# Altium project INS_CAN.PrjPcb
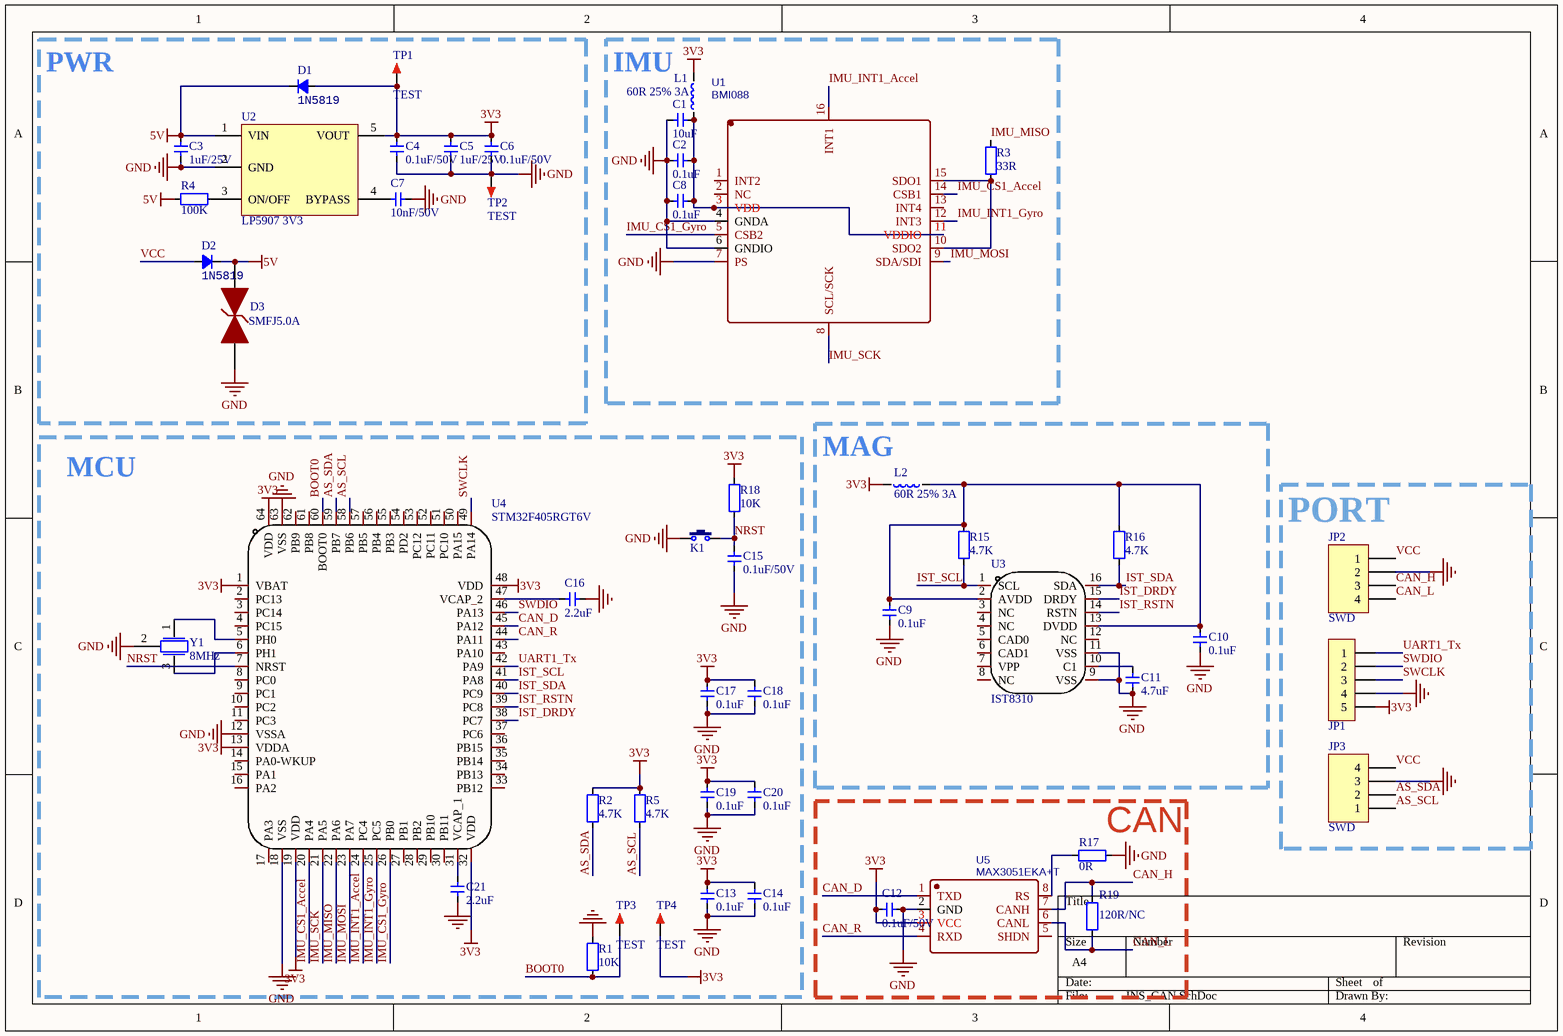
[diagram p0: INS_CAN.SchDoc]
1 sheet, 50 parts. Net scope: global (net labels, ports and power ports of the same name join across sheets).
Board file: INS_CAN.PcbDoc

## Sheet INS_CAN.SchDoc
size A4

### Parts
C1  10uF  [C0402]
C2  0.1uF  [C0402]
C3  1uF/25V  [C0402]
C4  0.1uF/50V  [C0402]
C5  1uF/25V  [C0402]
C6  0.1uF/50V  [C0402]
C7  10nF/50V  [C0402]
C8  0.1uF  [C0402]
C9  0.1uF  [C0402]
C10  0.1uF  [C0402]
C11  4.7uF  [C0402]
C12  0.1uF/50V  [C0402]
C13  0.1uF  [C0402]
C14  0.1uF  [C0402]
C15  0.1uF/50V  [C0402]
C16  2.2uF  [C0402]
C17  0.1uF  [C0402]
C18  0.1uF  [C0402]
C19  0.1uF  [C0402]
C20  0.1uF  [C0402]
C21  2.2uF  [C0402]
D1  1N5819  [D_SOD323]
D2  1N5819  [D_SOD323]
D3  SMFJ5.0A  [D_SOD123A]
JP1  HDR-1X5  [MX 1.25-WS-5P]  (value not drawn)
JP2  SWD  [GH1.25-WS-4P]
JP3  SWD  [GH1.25-WS-4P]
K1  6x6x5  [SWPBS_SPST_3X2X1]  (value not drawn)
L1  60R 25% 3A  [R0402]
L2  60R 25% 3A  [R0402]
R1  10K  [R0402]
R2  4.7K  [R0402]
R3  33R  [R0402]
R4  100K  [R0402]
R5  4.7K  [R0402]
R15  4.7K  [R0402]
R16  4.7K  [R0402]
R17  0R  [R0402]
R18  10K  [R0402]
R19  120R/NC  [R0402]
TP1  TEST  [TEST 1]
TP2  TEST  [TEST 1]
TP3  TEST  [TEST 1]
TP4  TEST  [TEST 1]
U1  BMI088  [QFN16 BMI]
U2  LP5907 3V3  [SOT23-5L]
U3  IST8310  [QFN50_16T_3X3_IST]
U4  STM32F405RGT6V  [LQFP64 10x10_L]
U5  MAX3051EKA+T  [SOT23-8L]
Y1  8MHz  [CSTCE3213]

### Blocks framed on the sheet
PWR: C3-C7 D1-D3 R4 TP1 TP2 U2
IMU: C1 C2 C8 L1 R3 U1
MCU: C13-C21 K1 R1 R2 R5 R18 TP3 TP4 U4 Y1
MAG: C9-C11 L2 R15 R16 U3
PORT: JP1-JP3
CAN: C12 R17 R19 U5

### Nets
3V3: C4.2 C5.2 C6.2 C12.2 C13.1 C14.1 C17.1 C18.1 C19.1 C20.1 D1.1(A) JP1.5 L1.2 L2.2 R2.2 R5.2 R18.2 TP1.1 TP4.1 U2.5(VOUT) U4.1(VBAT) U4.13(VDDA) U4.19(VDD) U4.32(VDD) U4.48(VDD) U4.64(VDD) U5.3(VCC)
5V: C3.2 D1.2(K) D2.2(K) D3.2 R4.1 U2.1(VIN)
GND: C1.2 C2.2 C3.1 C4.1 C5.1 C6.1 C7.1 C8.2 C9.2 C10.2 C11.2 C12.1 C13.2 C14.2 C15.1 C16.2 C17.2 C18.2 C19.2 C20.2 C21.2 D3.1 JP1.4 JP2.2 JP3.3 K1.1 R1.2 R17.1 TP2.1 U1.4(GNDA) U1.6(GNDIO) U1.7(PS) U2.2(GND) U3.9(VSS) U3.11(VSS) U4.12(VSSA) U4.18(VSS) U4.63(VSS) U5.2(GND) Y1.2
AS_SCL: JP3.1 R5.1 U4.58(PB6)
AS_SDA: JP3.2 R2.1 U4.59(PB7)
BOOT0: R1.1 TP3.1 U4.60(BOOT0)
CAN_D: U4.45(PA12) U5.1(TXD)
CAN_H: JP2.3 R19.1 U5.7(CANH)
CAN_L: JP2.4 R19.2 U5.6(CANL)
CAN_R: U4.44(PA11) U5.4(RXD)
IMU_CS1_Accel: U1.14(CSB1) U4.20(PA4)
IMU_CS1_Gyro: U1.5(CSB2) U4.26(PB0)
IMU_INT1_Accel: U1.16(INT1) U4.24(PC4)
IMU_INT1_Gyro: U1.12(INT3) U4.25(PC5)
IMU_MISO: R3.2 U4.22(PA6)
IMU_MOSI: U1.9(SDA/SDI) U4.23(PA7)
IMU_SCK: U1.8(SCL/SCK) U4.21(PA5)
IST_DRDY: U3.15(DRDY) U4.38(PC7)
IST_RSTN: U3.14(RSTN) U4.39(PC8)
IST_SCL: R15.1 U3.1(SCL) U4.41(PA8)
IST_SDA: R16.1 U3.16(SDA) U4.40(PC9)
NRST: C15.2 K1.2 R18.1 U4.7(NRST)
SWCLK: JP1.3 U4.49(PA14)
SWDIO: JP1.2 U4.46(PA13)
UART1_Tx: JP1.1 U4.42(PA9)
VCC: D2.1(A) JP2.1 JP3.4
NetC1_1: C1.1 C2.1 C8.1 L1.1 U1.3(VDD) U1.11(VDDIO)
NetC7_2: C7.2 U2.4(BYPASS)
NetC9_1: C9.1 C10.1 L2.1 R15.2 R16.2 U3.2(AVDD) U3.13(DVDD)
NetC11_1: C11.1 U3.10(C1)
NetC16_1: C16.1 U4.47(VCAP_2)
NetC21_1: C21.1 U4.31(VCAP_1)
NetR3_1: R3.1 U1.10(SDO2) U1.15(SDO1)
NetR4_2: R4.2 U2.3(ON/OFF)
NetR17_2: R17.2 U5.8(RS)
NetU4_5: U4.5(PH0) Y1.1
NetU4_6: U4.6(PH1) Y1.3

Not connected (* = marked no-connect by the designer): U1 1(INT2) 2(NC) 13(INT4); U3 3(NC) 4(NC) 5(CAD0) 6(CAD1) 7(VPP) 8(NC) 12(NC); U4 2(PC13) 3(PC14) 4(PC15) 8(PC0) 9(PC1) 10(PC2) 11(PC3) 14(PA0-WKUP) 15(PA1) 16(PA2) 17(PA3) 27(PB1) 28(PB2) 29(PB10) 30(PB11) 33(PB12) 34(PB13) 35(PB14) 36(PB15) 37(PC6) 43(PA10) 50(PA15) 51(PC10) 52(PC11) 53(PC12) 54(PD2) 55(PB3) 56(PB4) 57(PB5) 61(PB8) 62(PB9); U5 5(SHDN)

### Library data of the parts
C1-C21 = 电容-0402: Capacitor; Value: 0.1u
D1 D2 = Diode_SMA: Diode; Type: SMA; Value: 1N5819
D3 = SMBJ28CA
JP1 = Header 5: 5P接插件; 版权归属: 源创客; BOM名称: 5P接插件; 学习资源: www.ooocke.com
JP2 JP3 = Header 1*4
K1 = TSW DIP-6x6_V: 侧按直插6x6轻触开关; 版权归属: 源创客; BOM名称: 直插6x6轻触开关; 学习资源: www.ooocke.com
L1 L2 = L: 小功率贴片电感; 版权归属: 源创客; BOM名称: 小功率贴片电感; 学习资源: www.ooocke.com
R1-R5 R15-R19 = 电阻-0402: Resistor; Value: 22R
TP1-TP4 = TEST: 测试点; 版权归属: 源创客; BOM名称: 测试点; 学习资源: www.ooocke.com
U1 = BMI088: BOM_Manufacturer: Bosch Sensortec; Contributor: LCSC; BOM_Supplier: LCSC; BOM_Supplier Part: C194919; BOM_Manufacturer Part: BMI088; BOM_JLCPCB Part Class: Extended Part; spicePre: U; spiceSymbolName: BMI088
U2 = LP2992: LDO
U3 = IST8310: Add into BOM: yes; Name: IST8310; Symbol: IST8310; Device: IST8310; LCSC Part Name: IST8310; Supplier Part: C9900047266; Manufacturer Part: IST8310; Supplier Footprint: LGA-16; Supplier: LCSC; Convert to PCB: yes
U4 = STM32F405RGT6V: Manufacturer: ST(意法半导体); Add into BOM: yes; Name: STM32F405RGT6V; Symbol: STM32F405RGT6V; Device: STM32F405RGT6V; LCSC Part Name: STM32F405RGT6V; Supplier Part: C1338696; Manufacturer Part: STM32F405RGT6V; Supplier Footprint: LQFP-64(10x10); JLCPCB Part Class: 扩展库; Datasheet: https://atta.szlcsc.com/upload/public/pdf/source/20201130/C919362_39400D478C258148B3DF984CE4A4041A.pdf; Supplier: LCSC; Convert to PCB: yes
U5 = MAX3051EKA+T: BOM_Manufacturer: MAXIM; BOM_Supplier: LCSC; BOM_Manufacturer Part: MAX3051EKA+T; BOM_Supplier Part: C112005; BOM_JLCPCB Part Class: Extended Part; spicePre: U; spiceSymbolName: MAX3051EKA+T
Y1 = 晶振-3Pin: 村田贴片